# EAGLE schematic Linear Regulator LT3042 (EAGLE 7.6.0)
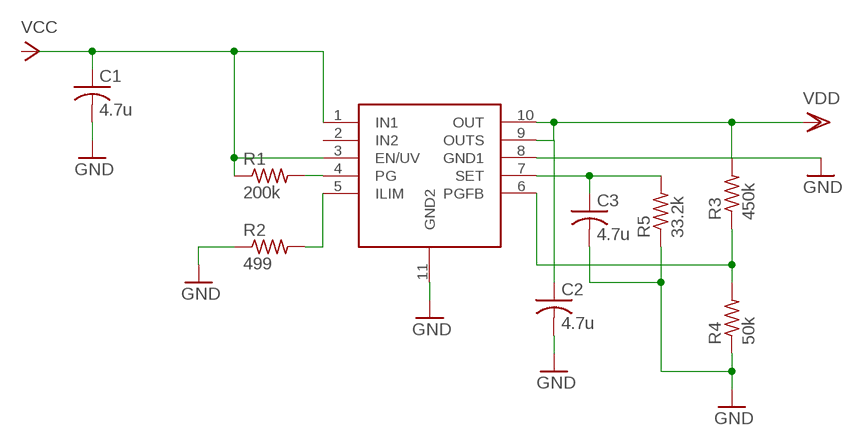
[diagram p0: schematic, sheet 1]

## Parts
C1  4.7u  C-USC0603  [C0603]
C2  4.7u  C-USC0603  [C0603]
C3  4.7u  C-USC0603  [C0603]
R1  200k  R-US_R0603  [R0603]
R2  499  R-US_R0603  [R0603]
R3  450k  R-US_R0603  [R0603]
R4  50k  R-US_R0603  [R0603]
R5  33.2k  R-US_R0603  [R0603]
U$1  LT3042  [LT3042]

## Nets
GND: C1.2 C2.2 C3.2 R2.1 R4.1 R5.1 U$1.8(GND1) U$1.11(GND2)
N$1: C1.1 R1.1 U$1.1(IN1) U$1.3(EN/UV)
N$2: R1.2 U$1.4(PG)
N$3: R2.2 U$1.5(ILIM)
N$4: R3.1 R4.2 U$1.6(PGFB)
N$5: C3.1 R5.2 U$1.7(SET)
VDD: C2.1 R3.2 U$1.9(OUTS) U$1.10(OUT)
Unconnected: U$1.2(IN2)

## Library data of the parts
C1-C3 = rcl:C-US: CAPACITOR, American symbol
R1-R5 = rcl:R-US_: RESISTOR, American symbol
U$1 = LT3042:LT3042